# EAGLE schematic master-gpio (EAGLE 7.5.0)
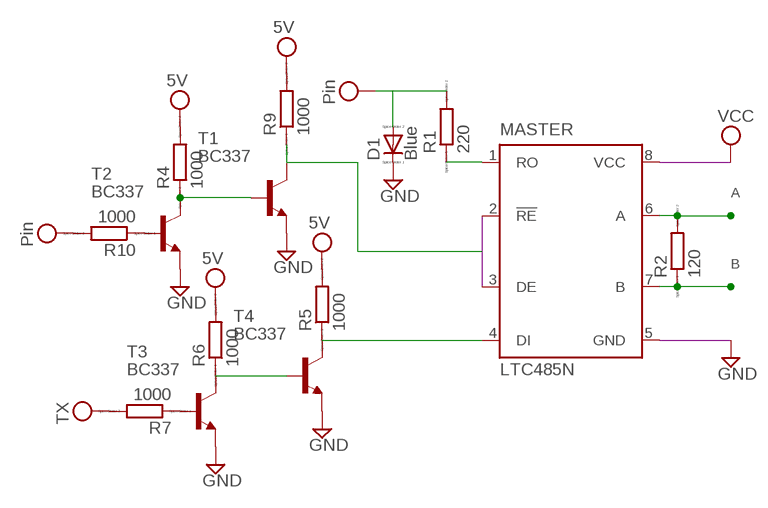
[diagram p0: schematic, sheet 1]

## Parts
D1  Blue  DIODE_E-  [DIODE_SMB]
MASTER  LTC485N  [DIL08]
R1  220  R  [R0805]
R2  120  R  [R0805]
R4  1000  R  [R0805]
R5  1000  R  [R0805]
R6  1000  R  [R0805]
R7  1000  R  [R0805]
R9  1000  R  [R0805]
R10  1000  R  [R0805]
T1  BC337  [TO92]
T2  BC337  [TO92]
T3  BC337  [TO92]
T4  BC337  [TO92]

## Nets
A: MASTER.6(A) R2.2
B: MASTER.7(B) R2.1
GND: D1.C(A) T1.1(E) T2.1(E) T3.1(E) T4.1(E)
N$1: R6.1 T3.3(C) T4.2(B)
N$2: R4.1 T1.2(B) T2.3(C)
N$3: MASTER.4(DI) R5.1 T4.3(C)
N$4: R7.1 T3.2(B)
N$5: MASTER.1(RO) R1.1
N$6: R9.1 T1.3(C)
N$7: R10.1 T2.2(B)
VCC: D1.A(C) R1.2 R4.2 R5.2 R6.2 R7.2 R9.2 R10.2 ; supply symbol labelled 5V, TX, Pin
Unconnected: MASTER.2(!RE) MASTER.3(DE) MASTER.5(GND) MASTER.8(VCC)

## Library data of the parts
D1 = eagle-ltspice:DIODE_E-: Schottky Diode; SPICEMODEL: diode; SPICEPREFIX: D
MASTER = linear-technology:LTC485: Low Power RS485 Interface Transceiver Source: http://www.linear.com/pc/downloadDocument.do?navId=H0,C1,C1007,C1017,P2064,D1718; OC_FARNELL: unknown; OC_NEWARK: unknown
R1 R2 R4-R7 R9 R10 = eagle-ltspice:R: RESISTOR, European symbol; SPICEMODEL: NONE; SPICEPREFIX: R
T1-T4 = transistor:BC337: NPN TRANSISTOR